# Altium schematic sheet nrf52833_qdaa_var6.SchDoc: nRF52833-QDAA Ref. Layout (LDO only, VDD supply, No USB)
size A4; Revision: 1.1; SheetNumber: 1; SheetTotal: 1; DrawnBy: RUBR; DocumentSize: A4; BoardTitle: nRF52833-QDAA Ref. Layout (LDO only, VDD supply, No USB)
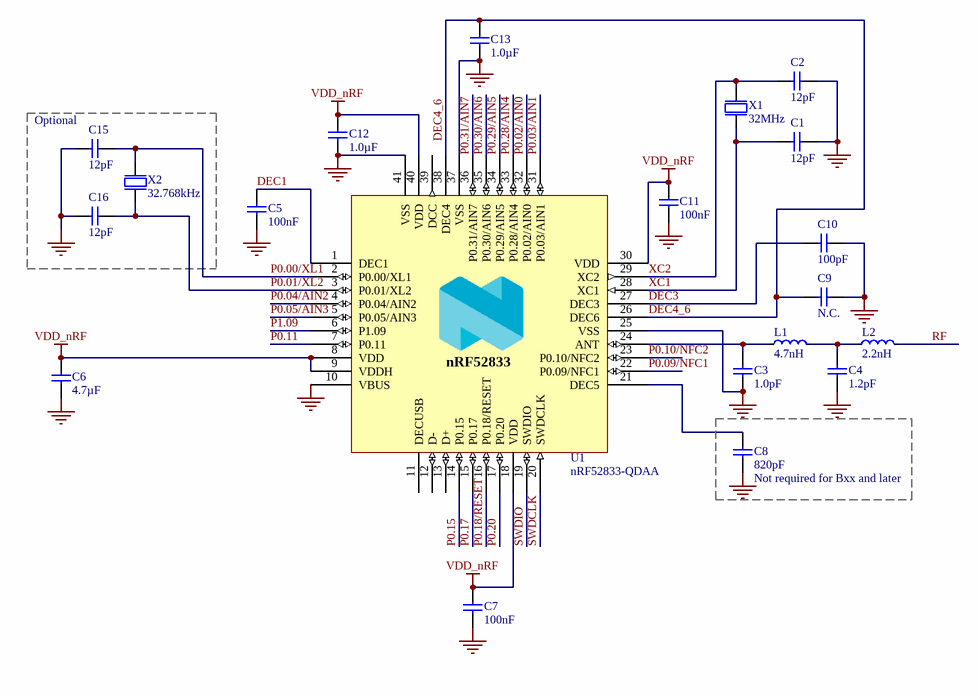
[diagram p0: nrf52833_qdaa_var6.SchDoc]

## Parts
C1  12pF  [CAPC0603X03L_C]
C2  12pF  [CAPC0603X03L_C]
C3  1.0pF  [CAPC0603X03L_C]
C4  1.2pF  [CAPC0603X03L_C]
C5  100nF  [CAPC0603X03L_C]
C6  4.7µF  [CAPC1608X06L]
C7  100nF  [CAPC0603X03L_C]
C8  820pF  Assembly: Not required for Bxx and later  [CAPC0603X03L_C]
C9  N.C.  [CAPC0603X03L_C]
C10  100pF  [CAPC0603X03L_C]
C11  100nF  [CAPC0603X03L_C]
C12  1.0µF  [CAPC1005X04L]
C13  1.0µF  [CAPC1005X04L]
C15  12pF  [CAPC0603X03L_C]
C16  12pF  [CAPC0603X03L_C]
L1  4.7nH  [INDC0603X03L_C]
L2  2.2nH  [INDC0603X03L_C]
U1  nRF52833-QDAA  [QFN40P500X500X50_HS-41N]
X1  32MHz  [BT-XTAL_1612]
X2  32.768kHz  [XTAL_2012]

## Blocks framed on the sheet
Optional: C15 C16 X2

## Nets
GND: C1.2 C2.2 C3.1 C4.1 C5.2 C6.2 C7.2 C8.2 C9.1 C10.2 C11.2 C12.2 C13.1 C15.2 C16.2 U1.10(VBUS) U1.25(VSS) U1.37(VSS) U1.41(VSS) X1.2(GND) X1.4(GND)
VDD_nRF: C6.1 C7.1 C11.1 C12.1 U1.8(VDD) U1.9(VDDH) U1.18(VDD) U1.30(VDD) U1.40(VDD)
DEC1: C5.1 U1.1(DEC1)
DEC3: C10.1 U1.27(DEC3)
DEC4_6: C9.2 C13.2 U1.26(DEC6) U1.38(DEC4)
P0.00/XL1: C15.1 U1.2(P0.00/XL1) X2.1(inp)
P0.01/XL2: C16.1 U1.3(P0.01/XL2) X2.2(out)
P0.02/AIN0: U1.32(P0.02/AIN0)
P0.03/AIN1: U1.31(P0.03/AIN1)
P0.04/AIN2: U1.4(P0.04/AIN2)
P0.05/AIN3: U1.5(P0.05/AIN3)
P0.09/NFC1: U1.22(P0.09/NFC1)
P0.10/NFC2: U1.23(P0.10/NFC2)
P0.11: U1.7(P0.11)
P0.15: U1.14(P0.15)
P0.17: U1.15(P0.17)
P0.18/RESET: U1.16(P0.18/RESET)
P0.20: U1.17(P0.20)
P0.28/AIN4: U1.33(P0.28/AIN4)
P0.29/AIN5: U1.34(P0.29/AIN5)
P0.30/AIN6: U1.35(P0.30/AIN6)
P0.31/AIN7: U1.36(P0.31/AIN7)
P1.09: U1.6(P1.09)
RF: L2.2
SWDCLK: U1.20(SWDCLK)
SWDIO: U1.19(SWDIO)
XC1: C1.1 U1.28(XC1) X1.1(inp)
XC2: C2.1 U1.29(XC2) X1.3(out)
NetC3_2: C3.2 L1.1 U1.24(ANT)
NetC4_2: C4.2 L1.2 L2.1
NetC8_1: C8.1 U1.21(DEC5)

Not connected (* = marked no-connect by the designer): U1 11(DECUSB) 12(D-) 13(D+) 39(DCC)

## Notes on the sheet
- Title
- Size
- Date:
- A4
- Project Number
- Sheet         of
- Revision
- File:
- Drawn By:
- (in symbol nRF52833-QDAA) nRF52833

## Library data of the parts
C1 C2 C15 C16 = C0201-12p: Capacitor, NP0, ±2%; Part Number: C0201-12p; LatestRevisionDate: 2017-11-09; Pin Count: 2; Publisher: Nordic Semiconductor; Published: 2014-11-13; Value: 12pF; Footprint Doc: 0201
C3 = C0201-1.0p: Capacitor, NP0, ±5%; Part Number: C0201-1.0p; LatestRevisionDate: 2018-10-22; Pin Count: 2; Publisher: Nordic Semiconductor; Published: 2014-11-13; Value: 1.0pF; Footprint Doc: 0201
C4 = C0201-1.2p: Capacitor, NP0, ±5%; Part Number: C0201-1.2p; LatestRevisionDate: 2014-11-13; Pin Count: 2; Publisher: Nordic Semiconductor; Published: 2014-11-13; Value: 1.2pF; Footprint Doc: 0201
C5 C7 C11 = C0201-100n: Capacitor, X7S, ±10%; Part Number: C0201-100n; LatestRevisionDate: 2017-11-09; Pin Count: 2; Publisher: Nordic Semiconductor; Published: 2014-11-13; Value: 100nF; Footprint Doc: 0201
C6 = C0603-4µ7-6.3V-X7R: Capacitor, X7R, ±10%; Part Number: C0603-4µ7-6.3V-X7R; LatestRevisionDate: 2015-06-10; Pin Count: 2; Publisher: Nordic Semiconductor; Published: 2015-06-10; Value: 4.7µF; Footprint Doc: 0603
C8 = C0201-820p: Capacitor, X7R, ±10%; Part Number: C0201-820p; LatestRevisionDate: 2017-11-09; Pin Count: 2; Publisher: Nordic Semiconductor; Published: 2014-11-13; Value: 820pF; Footprint Doc: 0201
C9 = C0201-N.C.: Not mounted; Assembly: Not mounted; Part Number: C0201-N.C.; LatestRevisionDate: 2014-11-13; Pin Count: 2; Publisher: Nordic Semiconductor; Published: 2014-11-13; Value: N.C.; Footprint Doc: 0201
C10 = C0201-100p: Capacitor, NP0, ±5%; Part Number: C0201-100p; LatestRevisionDate: 2017-11-09; Pin Count: 2; Publisher: Nordic Semiconductor; Published: 2014-11-13; Value: 100pF; Footprint Doc: 0201
C12 C13 = C0402-1µ0: Capacitor, X7S, ±10%; Part Number: C0402-1µ0; LatestRevisionDate: 2016-08-22; Pin Count: 2; Publisher: Nordic Semiconductor; Published: 2009-05-08; Value: 1.0µF; Footprint Doc: 0402
L1 = L0201-4n7: High frequency chip inductor ±5%; Part Number: L0201-4n7; LatestRevisionDate: 2013-04-10; Pin Count: 2; Publisher: Nordic Semiconductor; Published: 2013-04-10; Value: 4.7nH; Footprint Doc: 0201
L2 = L0201-2n2: High frequency chip inductor ±5%; Part Number: L0201-2n2; LatestRevisionDate: 2013-04-10; Pin Count: 2; Publisher: Nordic Semiconductor; Published: 2013-04-10; Value: 2.2nH; Footprint Doc: 0201
U1 = nRF52833-QDAA: Multi-protocol Bluetooth Low Energy, IEEE 802.15.4, ANT and 2.4GHz proprietary system-on-chip; Manufacturer: Nordic Semiconductor; Part Number: nRF52833-QDAA; Manufacturer Part Number: nRF52833-QDAA; LatestRevisionDate: 2018-12-03; Pin Count: 40; Publisher: Nordic Semiconductor; Published: 2018-12-03; Value: nRF52833-QDAA; Footprint Doc: QFN-40
X1 = XTAL_SMD1612_32MHz_8pF_General: XTAL SMD 1612, 32MHz, Cl=8pF, Total Tol: ±40ppm; Part Number: XTAL_SMD1612_32MHz_8pF_General; LatestRevisionDate: 2016-08-19; Pin Count: 4; Publisher: Nordic Semiconductor; Published: 2016-08-19; Value: 32MHz; Footprint Doc: XTAL_1612
X2 = XTAL_SMD2012_32.768kHz_9pF_General: XTAL SMD 2012, 32.768kHz, Cl=9pF, Total Tol: ±50ppm; Part Number: XTAL_SMD2012_32.768kHz_9pF_General; LatestRevisionDate: 2017-01-11; Pin Count: 2; Publisher: Nordic Semiconductor; Published: 2016-08-19; Value: 32.768kHz; Footprint Doc: XTAL_2012